# Altium schematic sheet BLE113_module.SchDoc
size A4
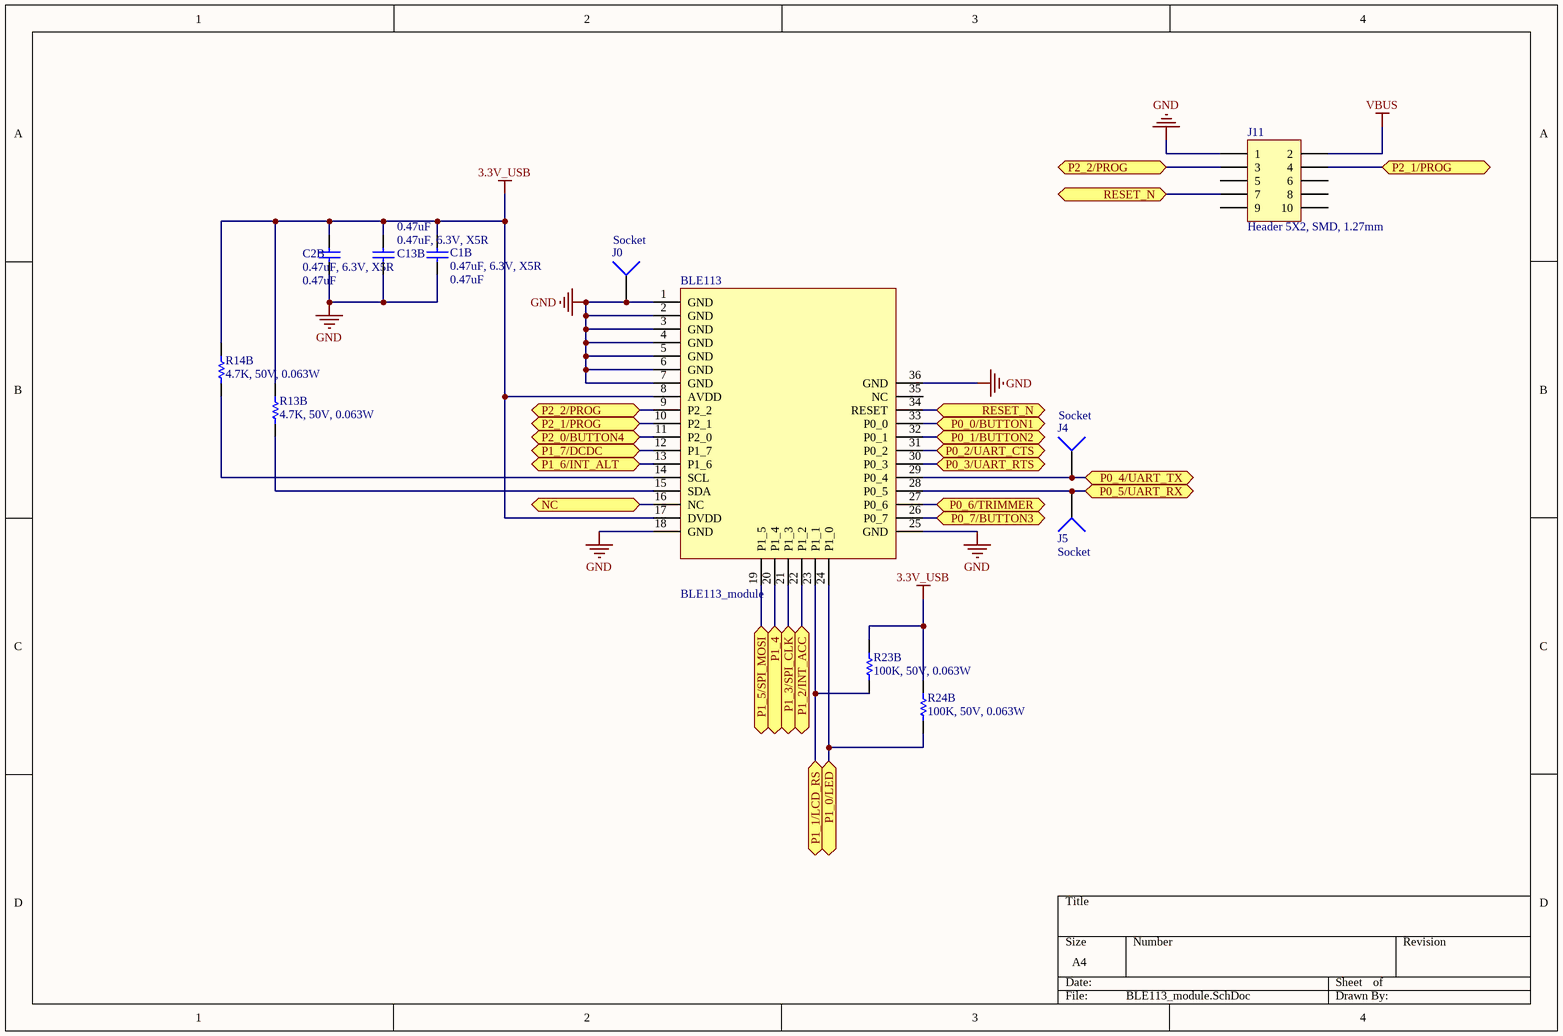
[diagram p0: BLE113_module.SchDoc]

## Parts
BLE113  BLE113_module  [BLE113 module]
C1B  0.47uF, 6.3V, X5R  value 0.47uF  [C0805]
C2B  0.47uF, 6.3V, X5R  value 0.47uF  [C0805]
C13B  0.47uF, 6.3V, X5R  value 0.47uF  [C0805]
J0  Socket  [PIN1]
J4  Socket  [PIN1]
J5  Socket  [PIN1]
J11  Header 5X2, SMD, 1.27mm  [MHDR2X5]
R13B  4.7K, 50V, 0.063W  [ERA-0805]
R14B  4.7K, 50V, 0.063W  [ERA-0805]
R23B  100K, 50V, 0.063W  [ERA-0805]
R24B  100K, 50V, 0.063W  [ERA-0805]

## Ports
NC, P0_0/BUTTON1 (bidir), P0_1/BUTTON2 (bidir), P0_2/UART_CTS (bidir), P0_3/UART_RTS (bidir), P0_4/UART_TX (bidir), P0_5/UART_RX (bidir), P0_6/TRIMMER (bidir), P0_7/BUTTON3 (bidir), P1_0/LED (bidir), P1_1/LCD_RS (bidir), P1_2/INT_ACC (bidir), P1_3/SPI_CLK (bidir), P1_4 (bidir), P1_5/SPI_MOSI (bidir), P1_6/INT_ALT (bidir), P1_7/DCDC (bidir), P2_0/BUTTON4 (bidir), P2_1/PROG (bidir), P2_2/PROG (bidir), RESET_N (bidir)

## Nets
3.3V_USB: BLE113.8(AVDD) BLE113.17(DVDD) C1B.2 C2B.2 C13B.2 R13B.2 R14B.2 R23B.2 R24B.2
GND: BLE113.1(GND) BLE113.2(GND) BLE113.3(GND) BLE113.4(GND) BLE113.5(GND) BLE113.6(GND) BLE113.7(GND) BLE113.18(GND) BLE113.25(GND) BLE113.36(GND) C1B.1 C2B.1 C13B.1 J0.1 J11.1
VBUS: J11.2
NC: BLE113.16(NC) ; port NC
P0_0/BUTTON1: BLE113.33(P0_0) ; port P0_0/BUTTON1
P0_1/BUTTON2: BLE113.32(P0_1) ; port P0_1/BUTTON2
P0_2/UART_CTS: BLE113.31(P0_2) ; port P0_2/UART_CTS
P0_3/UART_RTS: BLE113.30(P0_3) ; port P0_3/UART_RTS
P0_4/UART_TX: BLE113.29(P0_4) J4.1 ; port P0_4/UART_TX
P0_5/UART_RX: BLE113.28(P0_5) J5.1 ; port P0_5/UART_RX
P0_6/TRIMMER: BLE113.27(P0_6) ; port P0_6/TRIMMER
P0_7/BUTTON3: BLE113.26(P0_7) ; port P0_7/BUTTON3
P1_0/LED: BLE113.24(P1_0) R24B.1 ; port P1_0/LED
P1_1/LCD_RS: BLE113.23(P1_1) R23B.1 ; port P1_1/LCD_RS
P1_2/INT_ACC: BLE113.22(P1_2) ; port P1_2/INT_ACC
P1_3/SPI_CLK: BLE113.21(P1_3) ; port P1_3/SPI_CLK
P1_4: BLE113.20(P1_4) ; port P1_4
P1_5/SPI_MOSI: BLE113.19(P1_5) ; port P1_5/SPI_MOSI
P1_6/INT_ALT: BLE113.13(P1_6) ; port P1_6/INT_ALT
P1_7/DCDC: BLE113.12(P1_7) ; port P1_7/DCDC
P2_0/BUTTON4: BLE113.11(P2_0) ; port P2_0/BUTTON4
P2_1/PROG: BLE113.10(P2_1) J11.4 ; port P2_1/PROG
P2_2/PROG: BLE113.9(P2_2) J11.3 ; port P2_2/PROG
RESET_N: BLE113.34(RESET) J11.7 ; port RESET_N
NetBLE113_14: BLE113.14(SCL) R14B.1
NetBLE113_15: BLE113.15(SDA) R13B.1

Not connected (* = marked no-connect by the designer): BLE113 35(NC); J11 5 6 8 9 10

## Library data of the parts
C1B C2B C13B = Cap Semi: Capacitor (Semiconductor SIM Model); Published: 8-Jun-2000; LatestRevisionDate: 29-May-2009; LatestRevisionNote: IPC-7351 Footprint Added.; PackageReference: C1206; Publisher: Altium Limited; PackageDescription: Chip Capacitor
J11 = MHDR2X5: Header, 5-Pin, Dual row; LatestRevisionDate: 17-Jul-2002; LatestRevisionNote: Re-released for DXP Platform.; Publisher: Altium Limited
R13B R14B R23B R24B = ERAS: Metal Film Thermosensitive Chip Resistor, 0.56 Ohm to 10k Ohm Range, 5% Tolerance, 0805 Size, 0.1 W; Note: If flow soldering, adjust pad width of PCB Footprint to 0.7 - 0.8 times the width of the resistor.; Published: 17-Dec-2003; LatestRevisionDate: 19-Mar-2004; LatestRevisionNote: Silkscreen size reduced.; PackageReference: ERA-0805; Publisher: Altium Limited; PackageDocument: Mar-2003; Code_IPC: 2012 [0805]; ComponentLink1Description: Manufacturer Link; ComponentLink1URL: http://www.panasonic.com/industrial/components/resistive_products.htm; ComponentLink2Description: Datasheet; ComponentLink2URL: http://www.panasonic.com/industrial/components/pdf/AOF0000CE1.pdf
J0 J4 J5 = Socket: LatestRevisionDate: 17-Jul-2002; LatestRevisionNote: Re-released for DXP Platform.; Publisher: Altium Limited